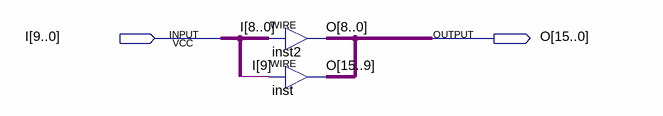
[diagram p0: schematic sheet]
// Quartus schematic SignExt10.bdf as structural Verilog: 2 symbols, 2 pins
module SignExt10 (
  input  [9:0] I,
  output [15:0] O
);

  assign O[8:0] = I[8:0];  // WIRE inst2
  assign O[15:9] = {7{I[9]}};  // WIRE inst
endmodule
